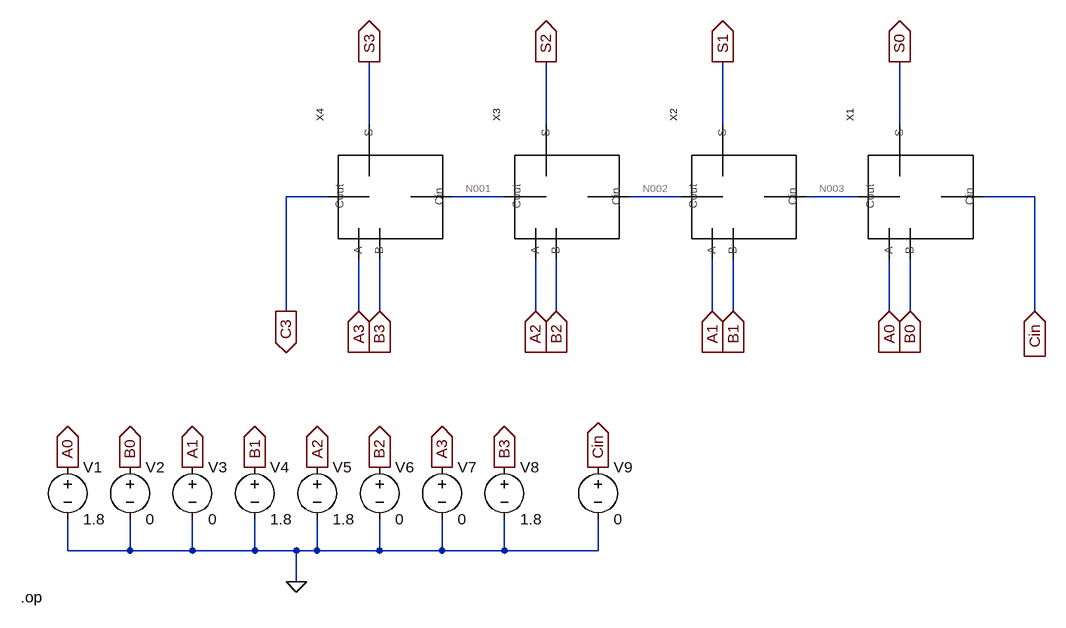
[diagram p0: schematic Task_5.asc]
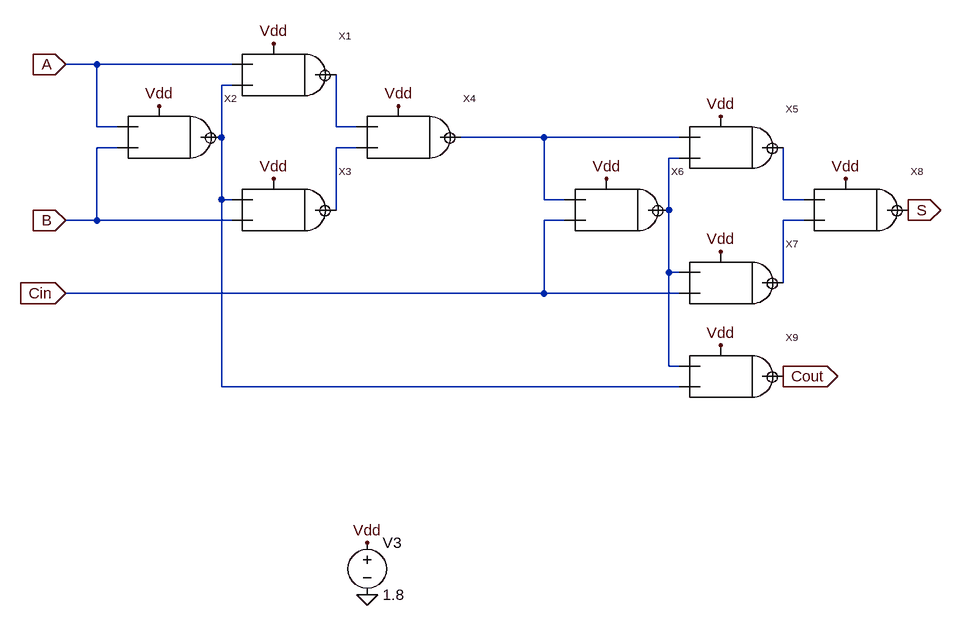
[diagram p1: sub-circuit full_adder.asc]
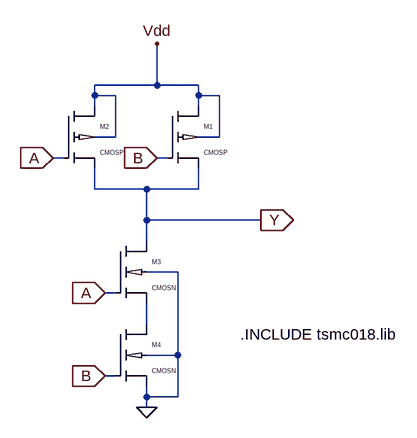
[diagram p2: sub-circuit nand2.asc]
Task_5.asc, the LTspice schematic file:
Version 4
SHEET 1 880 760
WIRE -480 16 -480 -80
WIRE -208 16 -208 -80
WIRE 64 16 64 -80
WIRE 336 16 336 -80
WIRE -544 128 -608 128
WIRE -272 128 -352 128
WIRE 0 128 -80 128
WIRE 272 128 192 128
WIRE 544 128 464 128
WIRE -608 304 -608 128
WIRE -496 304 -496 224
WIRE -464 304 -464 224
WIRE -224 304 -224 224
WIRE -192 304 -192 224
WIRE 48 304 48 224
WIRE 80 304 80 224
WIRE 320 304 320 224
WIRE 352 304 352 224
WIRE 544 304 544 128
WIRE -944 672 -944 624
WIRE -848 672 -848 624
WIRE -848 672 -944 672
WIRE -752 672 -752 624
WIRE -752 672 -848 672
WIRE -656 672 -656 624
WIRE -656 672 -752 672
WIRE -592 672 -656 672
WIRE -560 672 -560 624
WIRE -560 672 -592 672
WIRE -464 672 -464 624
WIRE -464 672 -560 672
WIRE -368 672 -368 624
WIRE -368 672 -464 672
WIRE -272 672 -272 624
WIRE -272 672 -368 672
WIRE -128 672 -128 624
WIRE -128 672 -272 672
WIRE -592 720 -592 672
FLAG 544 304 Cin
IOPIN 544 304 In
FLAG 336 -80 S0
IOPIN 336 -80 Out
FLAG 64 -80 S1
IOPIN 64 -80 Out
FLAG -208 -80 S2
IOPIN -208 -80 Out
FLAG -480 -80 S3
IOPIN -480 -80 Out
FLAG -608 304 C3
IOPIN -608 304 Out
FLAG 320 304 A0
IOPIN 320 304 In
FLAG 48 304 A1
IOPIN 48 304 In
FLAG -224 304 A2
IOPIN -224 304 In
FLAG -496 304 A3
IOPIN -496 304 In
FLAG 352 304 B0
IOPIN 352 304 In
FLAG 80 304 B1
IOPIN 80 304 In
FLAG -192 304 B2
IOPIN -192 304 In
FLAG -464 304 B3
IOPIN -464 304 In
FLAG -592 720 0
FLAG -944 544 A0
IOPIN -944 544 Out
FLAG -848 544 B0
IOPIN -848 544 Out
FLAG -752 544 A1
IOPIN -752 544 Out
FLAG -656 544 B1
IOPIN -656 544 Out
FLAG -560 544 A2
IOPIN -560 544 Out
FLAG -464 544 B2
IOPIN -464 544 Out
FLAG -368 544 A3
IOPIN -368 544 Out
FLAG -272 544 B3
IOPIN -272 544 Out
FLAG -128 544 Cin
IOPIN -128 544 Out
SYMBOL Full_adder 368 128 R270
SYMATTR InstName X1
SYMBOL Full_adder 96 128 R270
SYMATTR InstName X2
SYMBOL Full_adder -176 128 R270
SYMATTR InstName X3
SYMBOL Full_adder -448 128 R270
SYMATTR InstName X4
SYMBOL voltage -944 528 R0
WINDOW 123 0 0 Left 0
WINDOW 39 0 0 Left 0
SYMATTR InstName V1
SYMATTR Value 1.8
SYMBOL voltage -848 528 R0
WINDOW 123 0 0 Left 0
WINDOW 39 0 0 Left 0
SYMATTR InstName V2
SYMATTR Value 0
SYMBOL voltage -752 528 R0
WINDOW 123 0 0 Left 0
WINDOW 39 0 0 Left 0
SYMATTR InstName V3
SYMATTR Value 0
SYMBOL voltage -656 528 R0
WINDOW 123 0 0 Left 0
WINDOW 39 0 0 Left 0
SYMATTR InstName V4
SYMATTR Value 1.8
SYMBOL voltage -560 528 R0
WINDOW 123 0 0 Left 0
WINDOW 39 0 0 Left 0
SYMATTR InstName V5
SYMATTR Value 1.8
SYMBOL voltage -464 528 R0
WINDOW 123 0 0 Left 0
WINDOW 39 0 0 Left 0
SYMATTR InstName V6
SYMATTR Value 0
SYMBOL voltage -368 528 R0
WINDOW 123 0 0 Left 0
WINDOW 39 0 0 Left 0
SYMATTR InstName V7
SYMATTR Value 0
SYMBOL voltage -272 528 R0
WINDOW 123 0 0 Left 0
WINDOW 39 0 0 Left 0
SYMATTR InstName V8
SYMATTR Value 1.8
SYMBOL voltage -128 528 R0
WINDOW 123 0 0 Left 0
WINDOW 39 0 0 Left 0
SYMATTR InstName V9
SYMATTR Value 0
TEXT -1016 744 Left 2 !.op

full_adder.asc, the sub-circuit schematic file:
Version 4
SHEET 1 1420 916
WIRE 96 80 48 80
WIRE 304 80 96 80
WIRE 304 112 288 112
WIRE 96 176 96 80
WIRE 128 176 96 176
WIRE 464 176 464 96
WIRE 496 176 464 176
WIRE 288 192 288 112
WIRE 784 192 656 192
WIRE 992 192 784 192
WIRE 128 208 96 208
WIRE 496 208 464 208
WIRE 992 224 976 224
WIRE 288 288 288 192
WIRE 304 288 288 288
WIRE 784 288 784 192
WIRE 816 288 784 288
WIRE 1152 288 1152 208
WIRE 1184 288 1152 288
WIRE 464 304 464 208
WIRE 976 304 976 224
WIRE 96 320 96 208
WIRE 96 320 48 320
WIRE 304 320 96 320
WIRE 816 320 784 320
WIRE 1184 320 1152 320
WIRE 976 400 976 304
WIRE 992 400 976 400
WIRE 1152 416 1152 320
WIRE 784 432 784 320
WIRE 784 432 48 432
WIRE 992 432 784 432
WIRE 976 544 976 400
WIRE 992 544 976 544
WIRE 288 576 288 288
WIRE 992 576 288 576
FLAG 48 80 A
IOPIN 48 80 In
FLAG 48 320 B
IOPIN 48 320 In
FLAG 48 432 Cin
IOPIN 48 432 In
FLAG 1152 560 Cout
IOPIN 1152 560 Out
FLAG 1344 304 S
IOPIN 1344 304 Out
FLAG 1248 256 Vdd
FLAG 1056 160 Vdd
FLAG 1056 368 Vdd
FLAG 1056 512 Vdd
FLAG 880 256 Vdd
FLAG 560 144 Vdd
FLAG 368 48 Vdd
FLAG 368 256 Vdd
FLAG 192 144 Vdd
FLAG 512 816 Vdd
FLAG 512 896 0
SYMBOL NAND2 368 96 R0
SYMATTR InstName X1
SYMBOL NAND2 192 192 R0
SYMATTR InstName X2
SYMBOL NAND2 368 304 R0
SYMATTR InstName X3
SYMBOL NAND2 560 192 R0
SYMATTR InstName X4
SYMBOL NAND2 1056 208 R0
SYMATTR InstName X5
SYMBOL NAND2 880 304 R0
SYMATTR InstName X6
SYMBOL NAND2 1056 416 R0
SYMATTR InstName X7
SYMBOL NAND2 1248 304 R0
SYMATTR InstName X8
SYMBOL NAND2 1056 560 R0
SYMATTR InstName X9
SYMBOL voltage 512 800 R0
WINDOW 123 0 0 Left 0
WINDOW 39 0 0 Left 0
SYMATTR InstName V3
SYMATTR Value 1.8

nand2.asc, the sub-circuit schematic file:
Version 4
SHEET 1 880 680
WIRE 320 16 320 -48
WIRE 320 16 224 16
WIRE 384 16 320 16
WIRE 224 32 224 16
WIRE 256 32 224 32
WIRE 384 32 384 16
WIRE 416 32 384 32
WIRE 224 48 224 32
WIRE 384 48 384 32
WIRE 256 96 256 32
WIRE 256 96 224 96
WIRE 416 96 416 32
WIRE 416 96 384 96
WIRE 176 128 160 128
WIRE 336 128 320 128
WIRE 224 176 224 144
WIRE 304 176 224 176
WIRE 384 176 384 144
WIRE 384 176 304 176
WIRE 304 224 304 176
WIRE 480 224 304 224
WIRE 304 256 304 224
WIRE 352 304 304 304
WIRE 256 336 240 336
WIRE 304 384 304 352
WIRE 352 432 352 304
WIRE 352 432 304 432
WIRE 256 464 240 464
WIRE 304 496 304 480
WIRE 352 496 352 432
WIRE 352 496 304 496
WIRE 304 512 304 496
FLAG 304 512 0
FLAG 160 128 A
IOPIN 160 128 In
FLAG 240 336 A
IOPIN 240 336 In
FLAG 320 128 B
IOPIN 320 128 In
FLAG 240 464 B
IOPIN 240 464 In
FLAG 480 224 Y
IOPIN 480 224 Out
FLAG 320 -48 Vdd
SYMBOL Pcmos 336 48 R0
SYMATTR InstName M1
SYMBOL Pcmos 176 48 R0
SYMATTR InstName M2
SYMBOL Ncmos 256 256 R0
SYMATTR InstName M3
SYMBOL Ncmos 256 384 R0
SYMATTR InstName M4
TEXT 448 400 Left 2 !.INCLUDE tsmc018.lib

The netlist it stands for:
* Task_5.asc
XX1 A0 B0 S0 Cin N003 full_adder
XX2 A1 B1 S1 N003 N002 full_adder
XX3 A2 B2 S2 N002 N001 full_adder
XX4 A3 B3 S3 N001 C3 full_adder
V1 A0 0 1.8
V2 B0 0 0
V3 A1 0 0
V4 B1 0 1.8
V5 A2 0 1.8
V6 B2 0 0
V7 A3 0 0
V8 B3 0 1.8
V9 Cin 0 0

* block symbol definitions
.subckt full_adder A B S Cin Cout
XX1 N002 A N001 Vdd nand2
XX2 N001 A B Vdd nand2
XX3 N004 N001 B Vdd nand2
XX4 N003 N002 N004 Vdd nand2
XX5 N006 N003 N005 Vdd nand2
XX6 N005 N003 Cin Vdd nand2
XX7 N007 N005 Cin Vdd nand2
XX8 S N006 N007 Vdd nand2
XX9 Cout N005 N001 Vdd nand2
V3 Vdd 0 1.8
.ends full_adder

.subckt nand2 Y A B Vdd
M1 Vdd B Y Vdd CMOSP
M2 Vdd A Y Vdd CMOSP
M3 Y A N001 0 CMOSN
M4 N001 B 0 0 CMOSN
.INCLUDE tsmc018.lib
.ends nand2

.model NMOS NMOS
.model PMOS PMOS
.lib standard.mos
.op
.lib tsmc018.lib
.backanno
.end

* Results of the author's LTspice run, read from the files saved beside the schematic
* Operating Point:
*   V(a0) = 1.8 V
*   V(b0) = 0 V
*   V(cin) = 0 V
*   V(s0) = 1.8 V
*   V(n003) = 57.77 nV
*   V(a1) = 0 V
*   V(b1) = 1.8 V
*   V(s1) = 1.8 V
*   V(n002) = 57.77 nV
*   V(a2) = 1.8 V
*   V(b2) = 0 V
*   V(s2) = 1.8 V
*   V(n001) = 57.77 nV
*   V(a3) = 0 V
*   V(b3) = 1.8 V
*   V(s3) = 1.8 V
*   V(c3) = 57.77 nV
*   I(V9) = 0 A
*   I(V8) = 0 A
*   I(V7) = 0 A
*   I(V6) = 0 A
*   I(V5) = 0 A
*   I(V4) = 0 A
*   I(V3) = 0 A
*   I(V2) = 0 A
*   I(V1) = 0 A
* From the log:
*   Semiconductor Device Operating Points:
*                           --- BSIM3 MOSFETS ---
*   Name:     m:x4:x9:4   m:x4:x9:3   m:x4:x9:2   m:x4:x9:1   m:x4:x8:4
*   Model:   x4:x9:cmosn x4:x9:cmosn x4:x9:cmosp x4:x9:cmosp x4:x8:cmosn
*   Id:        1.00e-11    1.00e-11    3.21e-12    3.21e-12    9.67e-12
*   Vgs:       1.80e+00    1.80e+00    1.80e+00    1.80e+00    1.80e+00
*   Vds:       2.89e-08    2.89e-08    1.80e+00    1.80e+00    2.78e-08
*   Vbs:       0.00e+00   -2.89e-08    1.80e+00    1.80e+00    0.00e+00
*   Vth:       3.75e-01    3.75e-01   -3.92e-01   -3.92e-01    3.75e-01
*   Vdsat:     1.11e+00    1.11e+00   -3.31e-02   -3.31e-02    1.11e+00
*   Gm:        4.02e-12    4.02e-12    8.42e-11    8.42e-11    3.87e-12
*   Gds:       3.48e-04    3.48e-04    3.13e-13    3.13e-13    3.48e-04
*   Gmb        2.77e-12    2.77e-12    3.13e-11    3.13e-11    2.67e-12
*   Cbd:       0.00e+00    0.00e+00    0.00e+00    0.00e+00    0.00e+00
*   Cbs:       0.00e+00    0.00e+00    0.00e+00    0.00e+00    0.00e+00
*   Cgsov:     4.12e-15    4.12e-15    3.18e-15    3.18e-15    4.12e-15
*   Cgdov:     4.12e-15    4.12e-15    3.18e-15    3.18e-15    4.12e-15
*   Cgbov:     4.97e-18    4.97e-18    4.94e-18    4.94e-18    4.97e-18
*   dQgdVgb:   2.18e-13    2.18e-13    6.25e-14    6.25e-14    2.18e-13
*   dQgdVdb:  -1.06e-13   -1.06e-13   -3.17e-15   -3.17e-15   -1.06e-13
*   dQgdVsb:  -1.12e-13   -1.12e-13   -3.18e-15   -3.18e-15   -1.12e-13
*   dQddVgb:  -1.09e-13   -1.09e-13   -3.18e-15   -3.18e-15   -1.09e-13
*   dQddVdb:   9.45e-14    9.45e-14    3.17e-15    3.17e-15    9.45e-14
*   dQddVsb:   4.74e-14    4.74e-14    3.15e-18    3.15e-18    4.74e-14
*   dQbdVgb:  -4.05e-16   -4.05e-16   -5.62e-14   -5.62e-14   -4.05e-16
*   dQbdVdb:  -7.89e-14   -7.89e-14    1.85e-21    1.85e-21   -7.89e-14
*   dQbdVsb:   1.28e-14    1.28e-14    7.67e-19    7.67e-19    1.28e-14
*   Name:     m:x4:x8:3   m:x4:x8:2   m:x4:x8:1   m:x4:x7:4   m:x4:x7:3
*   Model:   x4:x8:cmosn x4:x8:cmosp x4:x8:cmosp x4:x7:cmosn x4:x7:cmosn
*   Id:        1.15e-11    1.15e-11    1.90e-17    1.09e-11    1.41e-11
*   Vgs:       2.99e-08   -1.80e+00   -3.51e-08    5.78e-08    3.77e-01
*   Vds:       1.80e+00    1.53e-07    1.53e-07    1.42e+00    3.77e-01
*   Vbs:      -2.78e-08    1.53e-07    1.53e-07    0.00e+00   -1.42e+00
*   Vth:       3.73e-01   -3.97e-01   -3.97e-01    3.74e-01    7.19e-01
*   Vdsat:     3.19e-02   -1.15e+00   -3.31e-02    3.19e-02    3.84e-02
*   Gm:        2.68e-10    5.95e-12    5.00e-16    2.62e-10    3.82e-10
*   Gds:       6.06e-13    7.52e-05    1.25e-10    5.97e-13    9.42e-13
*   Gmb        9.38e-11    3.72e-12    1.89e-16    9.16e-11    7.76e-11
*   Cbd:       0.00e+00    0.00e+00    0.00e+00    0.00e+00    0.00e+00
*   Cbs:       0.00e+00    0.00e+00    0.00e+00    0.00e+00    0.00e+00
*   Cgsov:     4.12e-15    3.18e-15    3.18e-15    4.12e-15    4.12e-15
*   Cgdov:     4.12e-15    3.18e-15    3.18e-15    4.12e-15    4.12e-15
*   Cgbov:     4.97e-18    4.94e-18    4.94e-18    4.97e-18    4.97e-18
*   dQgdVgb:   6.86e-14    2.15e-13    6.25e-14    6.86e-14    4.46e-14
*   dQgdVdb:  -4.11e-15   -1.04e-13   -3.18e-15   -4.11e-15   -4.11e-15
*   dQgdVsb:  -4.12e-15   -1.16e-13   -3.18e-15   -4.12e-15   -4.12e-15
*   dQddVgb:  -4.12e-15   -1.07e-13   -3.18e-15   -4.12e-15   -4.12e-15
*   dQddVdb:   4.11e-15    8.98e-14    3.18e-15    4.11e-15    4.11e-15
*   dQddVsb:   3.03e-18    5.06e-14    1.36e-18    3.00e-18    2.01e-18
*   dQbdVgb:  -6.03e-14   -4.09e-16   -5.62e-14   -6.03e-14   -3.63e-14
*   dQbdVdb:   8.60e-22   -7.20e-14   -2.39e-18    8.42e-22   -9.11e-23
*   dQbdVsb:   8.37e-19    1.16e-14    2.09e-18    8.49e-19    9.47e-19
*   Name:     m:x4:x7:2   m:x4:x7:1   m:x4:x6:4   m:x4:x6:3   m:x4:x6:2
*   Model:   x4:x7:cmosp x4:x7:cmosp x4:x6:cmosn x4:x6:cmosn x4:x6:cmosp
*   Id:        2.34e-17    1.41e-11    1.09e-11    1.41e-11    2.34e-17
*   Vgs:       0.00e+00   -1.80e+00    5.78e-08    3.77e-01   -8.88e-16
*   Vds:       1.88e-07    1.88e-07    1.42e+00    3.77e-01    1.88e-07
*   Vbs:       1.88e-07    1.88e-07    0.00e+00   -1.42e+00    1.88e-07
*   Vth:      -3.97e-01   -3.97e-01    3.74e-01    7.19e-01   -3.97e-01
*   Vdsat:    -3.31e-02   -1.15e+00    3.19e-02    3.84e-02   -3.31e-02
*   Gm:        6.15e-16    7.32e-12    2.62e-10    3.82e-10    6.15e-16
*   Gds:       1.25e-10    7.52e-05    5.97e-13    9.42e-13    1.25e-10
*   Gmb        2.33e-16    4.58e-12    9.16e-11    7.76e-11    2.33e-16
*   Cbd:       0.00e+00    0.00e+00    0.00e+00    0.00e+00    0.00e+00
*   Cbs:       0.00e+00    0.00e+00    0.00e+00    0.00e+00    0.00e+00
*   Cgsov:     3.18e-15    3.18e-15    4.12e-15    4.12e-15    3.18e-15
*   Cgdov:     3.18e-15    3.18e-15    4.12e-15    4.12e-15    3.18e-15
*   Cgbov:     4.94e-18    4.94e-18    4.97e-18    4.97e-18    4.94e-18
*   dQgdVgb:   6.25e-14    2.15e-13    6.86e-14    4.46e-14    6.25e-14
*   dQgdVdb:  -3.18e-15   -1.04e-13   -4.11e-15   -4.11e-15   -3.18e-15
*   dQgdVsb:  -3.18e-15   -1.16e-13   -4.12e-15   -4.12e-15   -3.18e-15
*   dQddVgb:  -3.18e-15   -1.07e-13   -4.12e-15   -4.12e-15   -3.18e-15
*   dQddVdb:   3.18e-15    8.98e-14    4.11e-15    4.11e-15    3.18e-15
*   dQddVsb:   1.36e-18    5.06e-14    3.00e-18    2.01e-18    1.36e-18
*   dQbdVgb:  -5.62e-14   -4.09e-16   -6.03e-14   -3.63e-14   -5.62e-14
*   dQbdVdb:  -2.39e-18   -7.20e-14    8.42e-22   -9.11e-23   -2.39e-18
*   dQbdVsb:   2.09e-18    1.16e-14    8.49e-19    9.47e-19    2.09e-18
*   Name:     m:x4:x6:1   m:x4:x5:4   m:x4:x5:3   m:x4:x5:2   m:x4:x5:1
*   Model:   x4:x6:cmosp x4:x5:cmosn x4:x5:cmosn x4:x5:cmosp x4:x5:cmosp
*   Id:        1.41e-11    1.00e-11    1.00e-11    3.21e-12    3.21e-12
*   Vgs:      -1.80e+00    1.80e+00    1.80e+00    1.80e+00    1.80e+00
*   Vds:       1.88e-07    2.89e-08    2.89e-08    1.80e+00    1.80e+00
*   Vbs:       1.88e-07    0.00e+00   -2.89e-08    1.80e+00    1.80e+00
*   Vth:      -3.97e-01    3.75e-01    3.75e-01   -3.92e-01   -3.92e-01
*   Vdsat:    -1.15e+00    1.11e+00    1.11e+00   -3.31e-02   -3.31e-02
*   Gm:        7.32e-12    4.02e-12    4.02e-12    8.42e-11    8.42e-11
*   Gds:       7.52e-05    3.48e-04    3.48e-04    3.13e-13    3.13e-13
*   Gmb        4.58e-12    2.77e-12    2.77e-12    3.13e-11    3.13e-11
*   Cbd:       0.00e+00    0.00e+00    0.00e+00    0.00e+00    0.00e+00
*   Cbs:       0.00e+00    0.00e+00    0.00e+00    0.00e+00    0.00e+00
*   Cgsov:     3.18e-15    4.12e-15    4.12e-15    3.18e-15    3.18e-15
*   Cgdov:     3.18e-15    4.12e-15    4.12e-15    3.18e-15    3.18e-15
*   Cgbov:     4.94e-18    4.97e-18    4.97e-18    4.94e-18    4.94e-18
*   dQgdVgb:   2.15e-13    2.18e-13    2.18e-13    6.25e-14    6.25e-14
*   dQgdVdb:  -1.04e-13   -1.06e-13   -1.06e-13   -3.17e-15   -3.17e-15
*   dQgdVsb:  -1.16e-13   -1.12e-13   -1.12e-13   -3.18e-15   -3.18e-15
*   dQddVgb:  -1.07e-13   -1.09e-13   -1.09e-13   -3.18e-15   -3.18e-15
*   dQddVdb:   8.98e-14    9.45e-14    9.45e-14    3.17e-15    3.17e-15
*   dQddVsb:   5.06e-14    4.74e-14    4.74e-14    3.15e-18    3.15e-18
*   dQbdVgb:  -4.09e-16   -4.05e-16   -4.05e-16   -5.62e-14   -5.62e-14
*   dQbdVdb:  -7.20e-14   -7.89e-14   -7.89e-14    1.85e-21    1.85e-21
*   dQbdVsb:   1.16e-14    1.28e-14    1.28e-14    7.67e-19    7.67e-19
*   Name:     m:x4:x4:4   m:x4:x4:3   m:x4:x4:2   m:x4:x4:1   m:x4:x3:4
*   Model:   x4:x4:cmosn x4:x4:cmosn x4:x4:cmosp x4:x4:cmosp x4:x3:cmosn
*   Id:        1.09e-11    1.41e-11    2.34e-17    1.41e-11    1.00e-11
*   Vgs:       5.78e-08    3.77e-01    3.51e-08   -1.80e+00    1.80e+00
*   Vds:       1.42e+00    3.77e-01    1.88e-07    1.88e-07    2.89e-08
*   Vbs:       0.00e+00   -1.42e+00    1.88e-07    1.88e-07    0.00e+00
*   Vth:       3.74e-01    7.19e-01   -3.97e-01   -3.97e-01    3.75e-01
*   Vdsat:     3.19e-02    3.84e-02   -3.31e-02   -1.15e+00    1.11e+00
*   Gm:        2.62e-10    3.82e-10    6.15e-16    7.32e-12    4.02e-12
*   Gds:       5.97e-13    9.42e-13    1.25e-10    7.52e-05    3.48e-04
*   Gmb        9.16e-11    7.76e-11    2.33e-16    4.58e-12    2.77e-12
*   Cbd:       0.00e+00    0.00e+00    0.00e+00    0.00e+00    0.00e+00
*   Cbs:       0.00e+00    0.00e+00    0.00e+00    0.00e+00    0.00e+00
*   Cgsov:     4.12e-15    4.12e-15    3.18e-15    3.18e-15    4.12e-15
*   Cgdov:     4.12e-15    4.12e-15    3.18e-15    3.18e-15    4.12e-15
*   Cgbov:     4.97e-18    4.97e-18    4.94e-18    4.94e-18    4.97e-18
*   dQgdVgb:   6.86e-14    4.46e-14    6.25e-14    2.15e-13    2.18e-13
*   dQgdVdb:  -4.11e-15   -4.11e-15   -3.18e-15   -1.04e-13   -1.06e-13
*   dQgdVsb:  -4.12e-15   -4.12e-15   -3.18e-15   -1.16e-13   -1.12e-13
*   dQddVgb:  -4.12e-15   -4.12e-15   -3.18e-15   -1.07e-13   -1.09e-13
*   dQddVdb:   4.11e-15    4.11e-15    3.18e-15    8.98e-14    9.45e-14
*   dQddVsb:   3.00e-18    2.01e-18    1.36e-18    5.06e-14    4.74e-14
*   dQbdVgb:  -6.03e-14   -3.63e-14   -5.62e-14   -4.09e-16   -4.05e-16
*   dQbdVdb:   8.42e-22   -9.11e-23   -2.39e-18   -7.20e-14   -7.89e-14
*   dQbdVsb:   8.49e-19    9.47e-19    2.09e-18    1.16e-14    1.28e-14
*   Name:     m:x4:x3:3   m:x4:x3:2   m:x4:x3:1   m:x4:x2:4   m:x4:x2:3
*   Model:   x4:x3:cmosn x4:x3:cmosp x4:x3:cmosp x4:x2:cmosn x4:x2:cmosn
*   Id:        1.00e-11    3.21e-12    3.21e-12    9.67e-12    1.15e-11
*   Vgs:       1.80e+00    1.80e+00    1.80e+00    1.80e+00   -2.78e-08
*   Vds:       2.89e-08    1.80e+00    1.80e+00    2.78e-08    1.80e+00
*   Vbs:      -2.89e-08    1.80e+00    1.80e+00    0.00e+00   -2.78e-08
*   Vth:       3.75e-01   -3.92e-01   -3.92e-01    3.75e-01    3.73e-01
*   Vdsat:     1.11e+00   -3.31e-02   -3.31e-02    1.11e+00    3.19e-02
*   Gm:        4.02e-12    8.42e-11    8.42e-11    3.87e-12    2.68e-10
*   Gds:       3.48e-04    3.13e-13    3.13e-13    3.48e-04    6.06e-13
*   Gmb        2.77e-12    3.13e-11    3.13e-11    2.67e-12    9.38e-11
*   Cbd:       0.00e+00    0.00e+00    0.00e+00    0.00e+00    0.00e+00
*   Cbs:       0.00e+00    0.00e+00    0.00e+00    0.00e+00    0.00e+00
*   Cgsov:     4.12e-15    3.18e-15    3.18e-15    4.12e-15    4.12e-15
*   Cgdov:     4.12e-15    3.18e-15    3.18e-15    4.12e-15    4.12e-15
*   Cgbov:     4.97e-18    4.94e-18    4.94e-18    4.97e-18    4.97e-18
*   dQgdVgb:   2.18e-13    6.25e-14    6.25e-14    2.18e-13    6.86e-14
*   dQgdVdb:  -1.06e-13   -3.17e-15   -3.17e-15   -1.06e-13   -4.11e-15
*   dQgdVsb:  -1.12e-13   -3.18e-15   -3.18e-15   -1.12e-13   -4.12e-15
*   dQddVgb:  -1.09e-13   -3.18e-15   -3.18e-15   -1.09e-13   -4.12e-15
*   dQddVdb:   9.45e-14    3.17e-15    3.17e-15    9.45e-14    4.11e-15
*   dQddVsb:   4.74e-14    3.15e-18    3.15e-18    4.74e-14    3.03e-18
*   dQbdVgb:  -4.05e-16   -5.62e-14   -5.62e-14   -4.05e-16   -6.03e-14
*   dQbdVdb:  -7.89e-14    1.85e-21    1.85e-21   -7.89e-14    8.60e-22
*   dQbdVsb:   1.28e-14    7.67e-19    7.67e-19    1.28e-14    8.37e-19
*   Name:     m:x4:x2:2   m:x4:x2:1   m:x4:x1:4   m:x4:x1:3   m:x4:x1:2
*   Model:   x4:x2:cmosp x4:x2:cmosp x4:x1:cmosn x4:x1:cmosn x4:x1:cmosp
*   Id:        1.15e-11    1.90e-17    9.67e-12    1.15e-11    1.15e-11
*   Vgs:      -1.80e+00    1.53e-07    1.80e+00   -2.78e-08   -1.80e+00
*   Vds:       1.53e-07    1.53e-07    2.78e-08    1.80e+00    1.53e-07
*   Vbs:       1.53e-07    1.53e-07    0.00e+00   -2.78e-08    1.53e-07
*   Vth:      -3.97e-01   -3.97e-01    3.75e-01    3.73e-01   -3.97e-01
*   Vdsat:    -1.15e+00   -3.31e-02    1.11e+00    3.19e-02   -1.15e+00
*   Gm:        5.95e-12    5.00e-16    3.87e-12    2.68e-10    5.95e-12
*   Gds:       7.52e-05    1.25e-10    3.48e-04    6.06e-13    7.52e-05
*   Gmb        3.72e-12    1.89e-16    2.67e-12    9.38e-11    3.72e-12
*   Cbd:       0.00e+00    0.00e+00    0.00e+00    0.00e+00    0.00e+00
*   Cbs:       0.00e+00    0.00e+00    0.00e+00    0.00e+00    0.00e+00
*   Cgsov:     3.18e-15    3.18e-15    4.12e-15    4.12e-15    3.18e-15
*   Cgdov:     3.18e-15    3.18e-15    4.12e-15    4.12e-15    3.18e-15
*   Cgbov:     4.94e-18    4.94e-18    4.97e-18    4.97e-18    4.94e-18
*   dQgdVgb:   2.15e-13    6.25e-14    2.18e-13    6.86e-14    2.15e-13
*   dQgdVdb:  -1.04e-13   -3.18e-15   -1.06e-13   -4.11e-15   -1.04e-13
*   dQgdVsb:  -1.16e-13   -3.18e-15   -1.12e-13   -4.12e-15   -1.16e-13
*   dQddVgb:  -1.07e-13   -3.18e-15   -1.09e-13   -4.12e-15   -1.07e-13
*   dQddVdb:   8.98e-14    3.18e-15    9.45e-14    4.11e-15    8.98e-14
*   dQddVsb:   5.06e-14    1.36e-18    4.74e-14    3.03e-18    5.06e-14
*   dQbdVgb:  -4.09e-16   -5.62e-14   -4.05e-16   -6.03e-14   -4.09e-16
*   dQbdVdb:  -7.20e-14   -2.39e-18   -7.89e-14    8.60e-22   -7.20e-14
*   dQbdVsb:   1.16e-14    2.09e-18    1.28e-14    8.37e-19    1.16e-14
*   Name:     m:x4:x1:1   m:x3:x9:4   m:x3:x9:3   m:x3:x9:2   m:x3:x9:1
*   Model:   x4:x1:cmosp x3:x9:cmosn x3:x9:cmosn x3:x9:cmosp x3:x9:cmosp
*   Id:        1.90e-17    1.00e-11    1.00e-11    3.21e-12    3.21e-12
*   Vgs:       2.22e-16    1.80e+00    1.80e+00    1.80e+00    1.80e+00
*   Vds:       1.53e-07    2.89e-08    2.89e-08    1.80e+00    1.80e+00
*   Vbs:       1.53e-07    0.00e+00   -2.89e-08    1.80e+00    1.80e+00
*   Vth:      -3.97e-01    3.75e-01    3.75e-01   -3.92e-01   -3.92e-01
*   Vdsat:    -3.31e-02    1.11e+00    1.11e+00   -3.31e-02   -3.31e-02
*   Gm:        5.00e-16    4.02e-12    4.02e-12    8.42e-11    8.42e-11
*   Gds:       1.25e-10    3.48e-04    3.48e-04    3.13e-13    3.13e-13
*   Gmb        1.89e-16    2.77e-12    2.77e-12    3.13e-11    3.13e-11
*   Cbd:       0.00e+00    0.00e+00    0.00e+00    0.00e+00    0.00e+00
*   Cbs:       0.00e+00    0.00e+00    0.00e+00    0.00e+00    0.00e+00
*   Cgsov:     3.18e-15    4.12e-15    4.12e-15    3.18e-15    3.18e-15
*   Cgdov:     3.18e-15    4.12e-15    4.12e-15    3.18e-15    3.18e-15
*   Cgbov:     4.94e-18    4.97e-18    4.97e-18    4.94e-18    4.94e-18
*   dQgdVgb:   6.25e-14    2.18e-13    2.18e-13    6.25e-14    6.25e-14
*   dQgdVdb:  -3.18e-15   -1.06e-13   -1.06e-13   -3.17e-15   -3.17e-15
*   dQgdVsb:  -3.18e-15   -1.12e-13   -1.12e-13   -3.18e-15   -3.18e-15
*   dQddVgb:  -3.18e-15   -1.09e-13   -1.09e-13   -3.18e-15   -3.18e-15
*   dQddVdb:   3.18e-15    9.45e-14    9.45e-14    3.17e-15    3.17e-15
*   dQddVsb:   1.36e-18    4.74e-14    4.74e-14    3.15e-18    3.15e-18
*   dQbdVgb:  -5.62e-14   -4.05e-16   -4.05e-16   -5.62e-14   -5.62e-14
*   dQbdVdb:  -2.39e-18   -7.89e-14   -7.89e-14    1.85e-21    1.85e-21
*   dQbdVsb:   2.09e-18    1.28e-14    1.28e-14    7.67e-19    7.67e-19
*   Name:     m:x3:x8:4   m:x3:x8:3   m:x3:x8:2   m:x3:x8:1   m:x3:x7:4
*   Model:   x3:x8:cmosn x3:x8:cmosn x3:x8:cmosp x3:x8:cmosp x3:x7:cmosn
*   Id:        9.67e-12    1.15e-11    1.15e-11    1.90e-17    1.09e-11
*   Vgs:       1.80e+00    2.99e-08   -1.80e+00   -3.51e-08    5.78e-08
*   Vds:       2.78e-08    1.80e+00    1.53e-07    1.53e-07    1.42e+00
*   Vbs:       0.00e+00   -2.78e-08    1.53e-07    1.53e-07    0.00e+00
*   Vth:       3.75e-01    3.73e-01   -3.97e-01   -3.97e-01    3.74e-01
*   Vdsat:     1.11e+00    3.19e-02   -1.15e+00   -3.31e-02    3.19e-02
*   Gm:        3.87e-12    2.68e-10    5.95e-12    5.00e-16    2.62e-10
*   Gds:       3.48e-04    6.06e-13    7.52e-05    1.25e-10    5.97e-13
*   Gmb        2.67e-12    9.38e-11    3.72e-12    1.89e-16    9.16e-11
*   Cbd:       0.00e+00    0.00e+00    0.00e+00    0.00e+00    0.00e+00
*   Cbs:       0.00e+00    0.00e+00    0.00e+00    0.00e+00    0.00e+00
*   Cgsov:     4.12e-15    4.12e-15    3.18e-15    3.18e-15    4.12e-15
*   Cgdov:     4.12e-15    4.12e-15    3.18e-15    3.18e-15    4.12e-15
*   Cgbov:     4.97e-18    4.97e-18    4.94e-18    4.94e-18    4.97e-18
*   dQgdVgb:   2.18e-13    6.86e-14    2.15e-13    6.25e-14    6.86e-14
*   dQgdVdb:  -1.06e-13   -4.11e-15   -1.04e-13   -3.18e-15   -4.11e-15
*   dQgdVsb:  -1.12e-13   -4.12e-15   -1.16e-13   -3.18e-15   -4.12e-15
*   dQddVgb:  -1.09e-13   -4.12e-15   -1.07e-13   -3.18e-15   -4.12e-15
*   dQddVdb:   9.45e-14    4.11e-15    8.98e-14    3.18e-15    4.11e-15
*   dQddVsb:   4.74e-14    3.03e-18    5.06e-14    1.36e-18    3.00e-18
*   dQbdVgb:  -4.05e-16   -6.03e-14   -4.09e-16   -5.62e-14   -6.03e-14
*   dQbdVdb:  -7.89e-14    8.60e-22   -7.20e-14   -2.39e-18    8.42e-22
*   dQbdVsb:   1.28e-14    8.37e-19    1.16e-14    2.09e-18    8.49e-19
*   Name:     m:x3:x7:3   m:x3:x7:2   m:x3:x7:1   m:x3:x6:4   m:x3:x6:3
*   Model:   x3:x7:cmosn x3:x7:cmosp x3:x7:cmosp x3:x6:cmosn x3:x6:cmosn
*   Id:        1.41e-11    2.34e-17    1.41e-11    1.09e-11    1.41e-11
*   Vgs:       3.77e-01   -6.66e-16   -1.80e+00    5.78e-08    3.77e-01
*   Vds:       3.77e-01    1.88e-07    1.88e-07    1.42e+00    3.77e-01
*   Vbs:      -1.42e+00    1.88e-07    1.88e-07    0.00e+00   -1.42e+00
*   Vth:       7.19e-01   -3.97e-01   -3.97e-01    3.74e-01    7.19e-01
*   Vdsat:     3.84e-02   -3.31e-02   -1.15e+00    3.19e-02    3.84e-02
*   Gm:        3.82e-10    6.15e-16    7.32e-12    2.62e-10    3.82e-10
*   Gds:       9.42e-13    1.25e-10    7.52e-05    5.97e-13    9.42e-13
*   Gmb        7.76e-11    2.33e-16    4.58e-12    9.16e-11    7.76e-11
*   Cbd:       0.00e+00    0.00e+00    0.00e+00    0.00e+00    0.00e+00
*   Cbs:       0.00e+00    0.00e+00    0.00e+00    0.00e+00    0.00e+00
*   Cgsov:     4.12e-15    3.18e-15    3.18e-15    4.12e-15    4.12e-15
*   Cgdov:     4.12e-15    3.18e-15    3.18e-15    4.12e-15    4.12e-15
*   Cgbov:     4.97e-18    4.94e-18    4.94e-18    4.97e-18    4.97e-18
*   dQgdVgb:   4.46e-14    6.25e-14    2.15e-13    6.86e-14    4.46e-14
*   dQgdVdb:  -4.11e-15   -3.18e-15   -1.04e-13   -4.11e-15   -4.11e-15
*   dQgdVsb:  -4.12e-15   -3.18e-15   -1.16e-13   -4.12e-15   -4.12e-15
*   dQddVgb:  -4.12e-15   -3.18e-15   -1.07e-13   -4.12e-15   -4.12e-15
*   dQddVdb:   4.11e-15    3.18e-15    8.98e-14    4.11e-15    4.11e-15
*   dQddVsb:   2.01e-18    1.36e-18    5.06e-14    3.00e-18    2.01e-18
*   dQbdVgb:  -3.63e-14   -5.62e-14   -4.09e-16   -6.03e-14   -3.63e-14
*   dQbdVdb:  -9.11e-23   -2.39e-18   -7.20e-14    8.42e-22   -9.11e-23
*   dQbdVsb:   9.47e-19    2.09e-18    1.16e-14    8.49e-19    9.47e-19
*   Name:     m:x3:x6:2   m:x3:x6:1   m:x3:x5:4   m:x3:x5:3   m:x3:x5:2
*   Model:   x3:x6:cmosp x3:x6:cmosp x3:x5:cmosn x3:x5:cmosn x3:x5:cmosp
*   Id:        2.34e-17    1.41e-11    1.00e-11    1.00e-11    3.21e-12
*   Vgs:       3.51e-08   -1.80e+00    1.80e+00    1.80e+00    1.80e+00
*   Vds:       1.88e-07    1.88e-07    2.89e-08    2.89e-08    1.80e+00
*   Vbs:       1.88e-07    1.88e-07    0.00e+00   -2.89e-08    1.80e+00
*   Vth:      -3.97e-01   -3.97e-01    3.75e-01    3.75e-01   -3.92e-01
*   Vdsat:    -3.31e-02   -1.15e+00    1.11e+00    1.11e+00   -3.31e-02
*   Gm:        6.15e-16    7.32e-12    4.02e-12    4.02e-12    8.42e-11
*   Gds:       1.25e-10    7.52e-05    3.48e-04    3.48e-04    3.13e-13
*   Gmb        2.33e-16    4.58e-12    2.77e-12    2.77e-12    3.13e-11
*   Cbd:       0.00e+00    0.00e+00    0.00e+00    0.00e+00    0.00e+00
*   Cbs:       0.00e+00    0.00e+00    0.00e+00    0.00e+00    0.00e+00
*   Cgsov:     3.18e-15    3.18e-15    4.12e-15    4.12e-15    3.18e-15
*   Cgdov:     3.18e-15    3.18e-15    4.12e-15    4.12e-15    3.18e-15
*   Cgbov:     4.94e-18    4.94e-18    4.97e-18    4.97e-18    4.94e-18
*   dQgdVgb:   6.25e-14    2.15e-13    2.18e-13    2.18e-13    6.25e-14
*   dQgdVdb:  -3.18e-15   -1.04e-13   -1.06e-13   -1.06e-13   -3.17e-15
*   dQgdVsb:  -3.18e-15   -1.16e-13   -1.12e-13   -1.12e-13   -3.18e-15
*   dQddVgb:  -3.18e-15   -1.07e-13   -1.09e-13   -1.09e-13   -3.18e-15
*   dQddVdb:   3.18e-15    8.98e-14    9.45e-14    9.45e-14    3.17e-15
*   dQddVsb:   1.36e-18    5.06e-14    4.74e-14    4.74e-14    3.15e-18
*   dQbdVgb:  -5.62e-14   -4.09e-16   -4.05e-16   -4.05e-16   -5.62e-14
*   dQbdVdb:  -2.39e-18   -7.20e-14   -7.89e-14   -7.89e-14    1.85e-21
*   dQbdVsb:   2.09e-18    1.16e-14    1.28e-14    1.28e-14    7.67e-19
*   Name:     m:x3:x5:1   m:x3:x4:4   m:x3:x4:3   m:x3:x4:2   m:x3:x4:1
*   Model:   x3:x5:cmosp x3:x4:cmosn x3:x4:cmosn x3:x4:cmosp x3:x4:cmosp
*   Id:        3.21e-12    9.67e-12    1.15e-11    1.15e-11    1.90e-17
*   Vgs:       1.80e+00    1.80e+00    2.99e-08   -1.80e+00   -3.51e-08
*   Vds:       1.80e+00    2.78e-08    1.80e+00    1.53e-07    1.53e-07
*   Vbs:       1.80e+00    0.00e+00   -2.78e-08    1.53e-07    1.53e-07
*   Vth:      -3.92e-01    3.75e-01    3.73e-01   -3.97e-01   -3.97e-01
*   Vdsat:    -3.31e-02    1.11e+00    3.19e-02   -1.15e+00   -3.31e-02
*   Gm:        8.42e-11    3.87e-12    2.68e-10    5.95e-12    5.00e-16
*   Gds:       3.13e-13    3.48e-04    6.06e-13    7.52e-05    1.25e-10
*   Gmb        3.13e-11    2.67e-12    9.38e-11    3.72e-12    1.89e-16
*   Cbd:       0.00e+00    0.00e+00    0.00e+00    0.00e+00    0.00e+00
*   Cbs:       0.00e+00    0.00e+00    0.00e+00    0.00e+00    0.00e+00
*   Cgsov:     3.18e-15    4.12e-15    4.12e-15    3.18e-15    3.18e-15
*   Cgdov:     3.18e-15    4.12e-15    4.12e-15    3.18e-15    3.18e-15
*   Cgbov:     4.94e-18    4.97e-18    4.97e-18    4.94e-18    4.94e-18
*   dQgdVgb:   6.25e-14    2.18e-13    6.86e-14    2.15e-13    6.25e-14
*   dQgdVdb:  -3.17e-15   -1.06e-13   -4.11e-15   -1.04e-13   -3.18e-15
*   dQgdVsb:  -3.18e-15   -1.12e-13   -4.12e-15   -1.16e-13   -3.18e-15
*   dQddVgb:  -3.18e-15   -1.09e-13   -4.12e-15   -1.07e-13   -3.18e-15
*   dQddVdb:   3.17e-15    9.45e-14    4.11e-15    8.98e-14    3.18e-15
*   dQddVsb:   3.15e-18    4.74e-14    3.03e-18    5.06e-14    1.36e-18
*   dQbdVgb:  -5.62e-14   -4.05e-16   -6.03e-14   -4.09e-16   -5.62e-14
*   dQbdVdb:   1.85e-21   -7.89e-14    8.60e-22   -7.20e-14   -2.39e-18
*   dQbdVsb:   7.67e-19    1.28e-14    8.37e-19    1.16e-14    2.09e-18
*   Name:     m:x3:x3:4   m:x3:x3:3   m:x3:x3:2   m:x3:x3:1   m:x3:x2:4
*   Model:   x3:x3:cmosn x3:x3:cmosn x3:x3:cmosp x3:x3:cmosp x3:x2:cmosn
*   Id:        1.09e-11    1.41e-11    2.34e-17    1.41e-11    1.09e-11
*   Vgs:       0.00e+00    3.77e-01   -5.55e-15   -1.80e+00    0.00e+00
*   Vds:       1.42e+00    3.77e-01    1.88e-07    1.88e-07    1.42e+00
*   Vbs:       0.00e+00   -1.42e+00    1.88e-07    1.88e-07    0.00e+00
*   Vth:       3.74e-01    7.19e-01   -3.97e-01   -3.97e-01    3.74e-01
*   Vdsat:     3.19e-02    3.84e-02   -3.31e-02   -1.15e+00    3.19e-02
*   Gm:        2.62e-10    3.82e-10    6.15e-16    7.32e-12    2.62e-10
*   Gds:       5.97e-13    9.42e-13    1.25e-10    7.52e-05    5.97e-13
*   Gmb        9.16e-11    7.76e-11    2.33e-16    4.58e-12    9.16e-11
*   Cbd:       0.00e+00    0.00e+00    0.00e+00    0.00e+00    0.00e+00
*   Cbs:       0.00e+00    0.00e+00    0.00e+00    0.00e+00    0.00e+00
*   Cgsov:     4.12e-15    4.12e-15    3.18e-15    3.18e-15    4.12e-15
*   Cgdov:     4.12e-15    4.12e-15    3.18e-15    3.18e-15    4.12e-15
*   Cgbov:     4.97e-18    4.97e-18    4.94e-18    4.94e-18    4.97e-18
*   dQgdVgb:   6.86e-14    4.46e-14    6.25e-14    2.15e-13    6.86e-14
*   dQgdVdb:  -4.11e-15   -4.11e-15   -3.18e-15   -1.04e-13   -4.11e-15
*   dQgdVsb:  -4.12e-15   -4.12e-15   -3.18e-15   -1.16e-13   -4.12e-15
*   dQddVgb:  -4.12e-15   -4.12e-15   -3.18e-15   -1.07e-13   -4.12e-15
*   dQddVdb:   4.11e-15    4.11e-15    3.18e-15    8.98e-14    4.11e-15
*   dQddVsb:   3.00e-18    2.01e-18    1.36e-18    5.06e-14    3.00e-18
*   dQbdVgb:  -6.03e-14   -3.63e-14   -5.62e-14   -4.09e-16   -6.03e-14
*   dQbdVdb:   8.42e-22   -9.11e-23   -2.39e-18   -7.20e-14    8.42e-22
*   dQbdVsb:   8.49e-19    9.47e-19    2.09e-18    1.16e-14    8.49e-19
*   Name:     m:x3:x2:3   m:x3:x2:2   m:x3:x2:1   m:x3:x1:4   m:x3:x1:3
*   Model:   x3:x2:cmosn x3:x2:cmosp x3:x2:cmosp x3:x1:cmosn x3:x1:cmosn
*   Id:        1.41e-11    2.34e-17    1.41e-11    1.00e-11    1.00e-11
*   Vgs:       3.77e-01    1.88e-07   -1.80e+00    1.80e+00    1.80e+00
*   Vds:       3.77e-01    1.88e-07    1.88e-07    2.89e-08    2.89e-08
*   Vbs:      -1.42e+00    1.88e-07    1.88e-07    0.00e+00   -2.89e-08
*   Vth:       7.19e-01   -3.97e-01   -3.97e-01    3.75e-01    3.75e-01
*   Vdsat:     3.84e-02   -3.31e-02   -1.15e+00    1.11e+00    1.11e+00
*   Gm:        3.82e-10    6.15e-16    7.32e-12    4.02e-12    4.02e-12
*   Gds:       9.42e-13    1.25e-10    7.52e-05    3.48e-04    3.48e-04
*   Gmb        7.76e-11    2.33e-16    4.58e-12    2.77e-12    2.77e-12
*   Cbd:       0.00e+00    0.00e+00    0.00e+00    0.00e+00    0.00e+00
*   Cbs:       0.00e+00    0.00e+00    0.00e+00    0.00e+00    0.00e+00
*   Cgsov:     4.12e-15    3.18e-15    3.18e-15    4.12e-15    4.12e-15
*   Cgdov:     4.12e-15    3.18e-15    3.18e-15    4.12e-15    4.12e-15
*   Cgbov:     4.97e-18    4.94e-18    4.94e-18    4.97e-18    4.97e-18
*   dQgdVgb:   4.46e-14    6.25e-14    2.15e-13    2.18e-13    2.18e-13
*   dQgdVdb:  -4.11e-15   -3.18e-15   -1.04e-13   -1.06e-13   -1.06e-13
*   dQgdVsb:  -4.12e-15   -3.18e-15   -1.16e-13   -1.12e-13   -1.12e-13
*   dQddVgb:  -4.12e-15   -3.18e-15   -1.07e-13   -1.09e-13   -1.09e-13
*   dQddVdb:   4.11e-15    3.18e-15    8.98e-14    9.45e-14    9.45e-14
*   dQddVsb:   2.01e-18    1.36e-18    5.06e-14    4.74e-14    4.74e-14
*   dQbdVgb:  -3.63e-14   -5.62e-14   -4.09e-16   -4.05e-16   -4.05e-16
*   dQbdVdb:  -9.11e-23   -2.39e-18   -7.20e-14   -7.89e-14   -7.89e-14
*   dQbdVsb:   9.47e-19    2.09e-18    1.16e-14    1.28e-14    1.28e-14
*   Name:     m:x3:x1:2   m:x3:x1:1   m:x2:x9:4   m:x2:x9:3   m:x2:x9:2
*   Model:   x3:x1:cmosp x3:x1:cmosp x2:x9:cmosn x2:x9:cmosn x2:x9:cmosp
*   Id:        3.21e-12    3.21e-12    1.00e-11    1.00e-11    3.21e-12
*   Vgs:       1.80e+00    1.80e+00    1.80e+00    1.80e+00    1.80e+00
*   Vds:       1.80e+00    1.80e+00    2.89e-08    2.89e-08    1.80e+00
*   Vbs:       1.80e+00    1.80e+00    0.00e+00   -2.89e-08    1.80e+00
*   Vth:      -3.92e-01   -3.92e-01    3.75e-01    3.75e-01   -3.92e-01
*   Vdsat:    -3.31e-02   -3.31e-02    1.11e+00    1.11e+00   -3.31e-02
*   Gm:        8.42e-11    8.42e-11    4.02e-12    4.02e-12    8.42e-11
*   Gds:       3.13e-13    3.13e-13    3.48e-04    3.48e-04    3.13e-13
*   Gmb        3.13e-11    3.13e-11    2.77e-12    2.77e-12    3.13e-11
*   Cbd:       0.00e+00    0.00e+00    0.00e+00    0.00e+00    0.00e+00
*   Cbs:       0.00e+00    0.00e+00    0.00e+00    0.00e+00    0.00e+00
*   Cgsov:     3.18e-15    3.18e-15    4.12e-15    4.12e-15    3.18e-15
*   Cgdov:     3.18e-15    3.18e-15    4.12e-15    4.12e-15    3.18e-15
*   Cgbov:     4.94e-18    4.94e-18    4.97e-18    4.97e-18    4.94e-18
*   dQgdVgb:   6.25e-14    6.25e-14    2.18e-13    2.18e-13    6.25e-14
*   dQgdVdb:  -3.17e-15   -3.17e-15   -1.06e-13   -1.06e-13   -3.17e-15
*   dQgdVsb:  -3.18e-15   -3.18e-15   -1.12e-13   -1.12e-13   -3.18e-15
*   dQddVgb:  -3.18e-15   -3.18e-15   -1.09e-13   -1.09e-13   -3.18e-15
*   dQddVdb:   3.17e-15    3.17e-15    9.45e-14    9.45e-14    3.17e-15
*   dQddVsb:   3.15e-18    3.15e-18    4.74e-14    4.74e-14    3.15e-18
*   dQbdVgb:  -5.62e-14   -5.62e-14   -4.05e-16   -4.05e-16   -5.62e-14
*   dQbdVdb:   1.85e-21    1.85e-21   -7.89e-14   -7.89e-14    1.85e-21
*   dQbdVsb:   7.67e-19    7.67e-19    1.28e-14    1.28e-14    7.67e-19
*   Name:     m:x2:x9:1   m:x2:x8:4   m:x2:x8:3   m:x2:x8:2   m:x2:x8:1
*   Model:   x2:x9:cmosp x2:x8:cmosn x2:x8:cmosn x2:x8:cmosp x2:x8:cmosp
*   Id:        3.21e-12    9.67e-12    1.15e-11    1.15e-11    1.90e-17
*   Vgs:       1.80e+00    1.80e+00    2.99e-08   -1.80e+00   -3.51e-08
*   Vds:       1.80e+00    2.78e-08    1.80e+00    1.53e-07    1.53e-07
*   Vbs:       1.80e+00    0.00e+00   -2.78e-08    1.53e-07    1.53e-07
*   Vth:      -3.92e-01    3.75e-01    3.73e-01   -3.97e-01   -3.97e-01
*   Vdsat:    -3.31e-02    1.11e+00    3.19e-02   -1.15e+00   -3.31e-02
*   Gm:        8.42e-11    3.87e-12    2.68e-10    5.95e-12    5.00e-16
*   Gds:       3.13e-13    3.48e-04    6.06e-13    7.52e-05    1.25e-10
*   Gmb        3.13e-11    2.67e-12    9.38e-11    3.72e-12    1.89e-16
*   Cbd:       0.00e+00    0.00e+00    0.00e+00    0.00e+00    0.00e+00
*   Cbs:       0.00e+00    0.00e+00    0.00e+00    0.00e+00    0.00e+00
*   Cgsov:     3.18e-15    4.12e-15    4.12e-15    3.18e-15    3.18e-15
*   Cgdov:     3.18e-15    4.12e-15    4.12e-15    3.18e-15    3.18e-15
*   Cgbov:     4.94e-18    4.97e-18    4.97e-18    4.94e-18    4.94e-18
*   dQgdVgb:   6.25e-14    2.18e-13    6.86e-14    2.15e-13    6.25e-14
*   dQgdVdb:  -3.17e-15   -1.06e-13   -4.11e-15   -1.04e-13   -3.18e-15
*   dQgdVsb:  -3.18e-15   -1.12e-13   -4.12e-15   -1.16e-13   -3.18e-15
*   dQddVgb:  -3.18e-15   -1.09e-13   -4.12e-15   -1.07e-13   -3.18e-15
*   dQddVdb:   3.17e-15    9.45e-14    4.11e-15    8.98e-14    3.18e-15
*   dQddVsb:   3.15e-18    4.74e-14    3.03e-18    5.06e-14    1.36e-18
*   dQbdVgb:  -5.62e-14   -4.05e-16   -6.03e-14   -4.09e-16   -5.62e-14